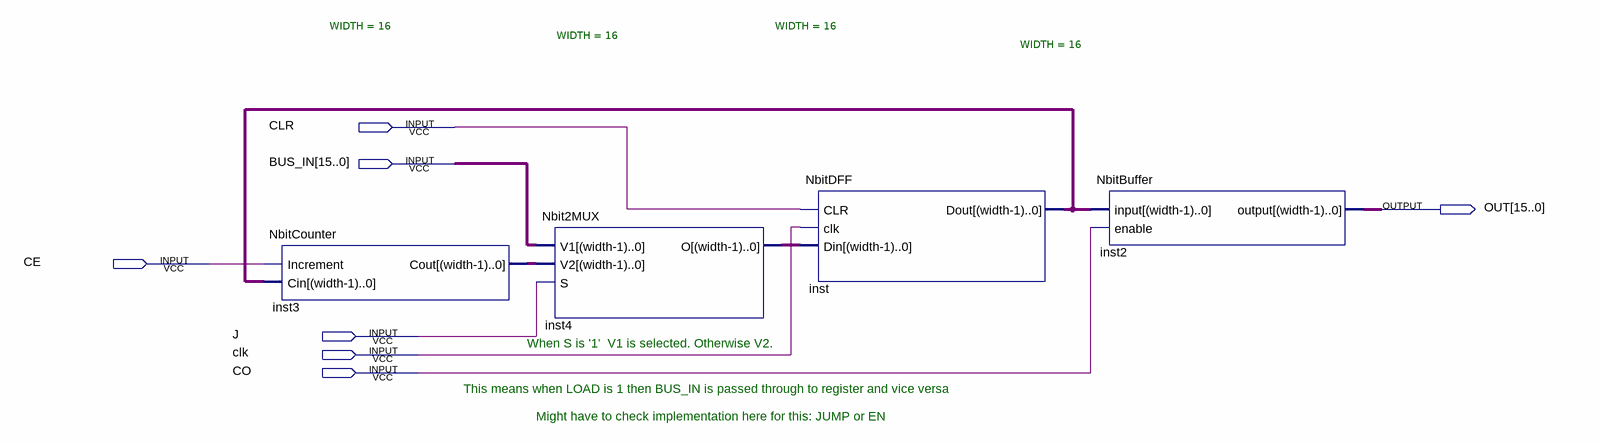
[diagram p0: schematic sheet]
// Quartus schematic ProgramCounter.bdf as structural Verilog: 4 symbols, 7 pins
module ProgramCounter (
  input  CLR,
  input  [15:0] BUS_IN,
  input  CE,
  input  J,
  input  clk,
  input  CO,
  output [15:0] OUT
);

  wire [15:0] inst3_cout, inst4_o, inst_dout;

  NbitCounter #(.WIDTH(16)) inst3 (.Increment(CE), .Cin(inst_dout), .Cout(inst3_cout));
  Nbit2MUX #(.WIDTH(16)) inst4 (.V1(BUS_IN), .V2(inst3_cout), .S(J), .O(inst4_o));
  NbitDFF #(.WIDTH(16)) inst (.CLR(CLR), .clk(clk), .Din(inst4_o), .Dout(inst_dout));
  NbitBuffer #(.WIDTH(16)) inst2 (.\input (inst_dout), .enable(CO), .\output (OUT));

  // Notes on the sheet:
  //   When S is '1'  V1 is selected. Otherwise V2.
  //   This means when LOAD is 1 then BUS_IN is passed through to register and vice versa
  //   Might have to check implementation here for this: JUMP or EN
endmodule
